# EAGLE design OctoWatchSchemePackage1 (EAGLE 9.4.2)
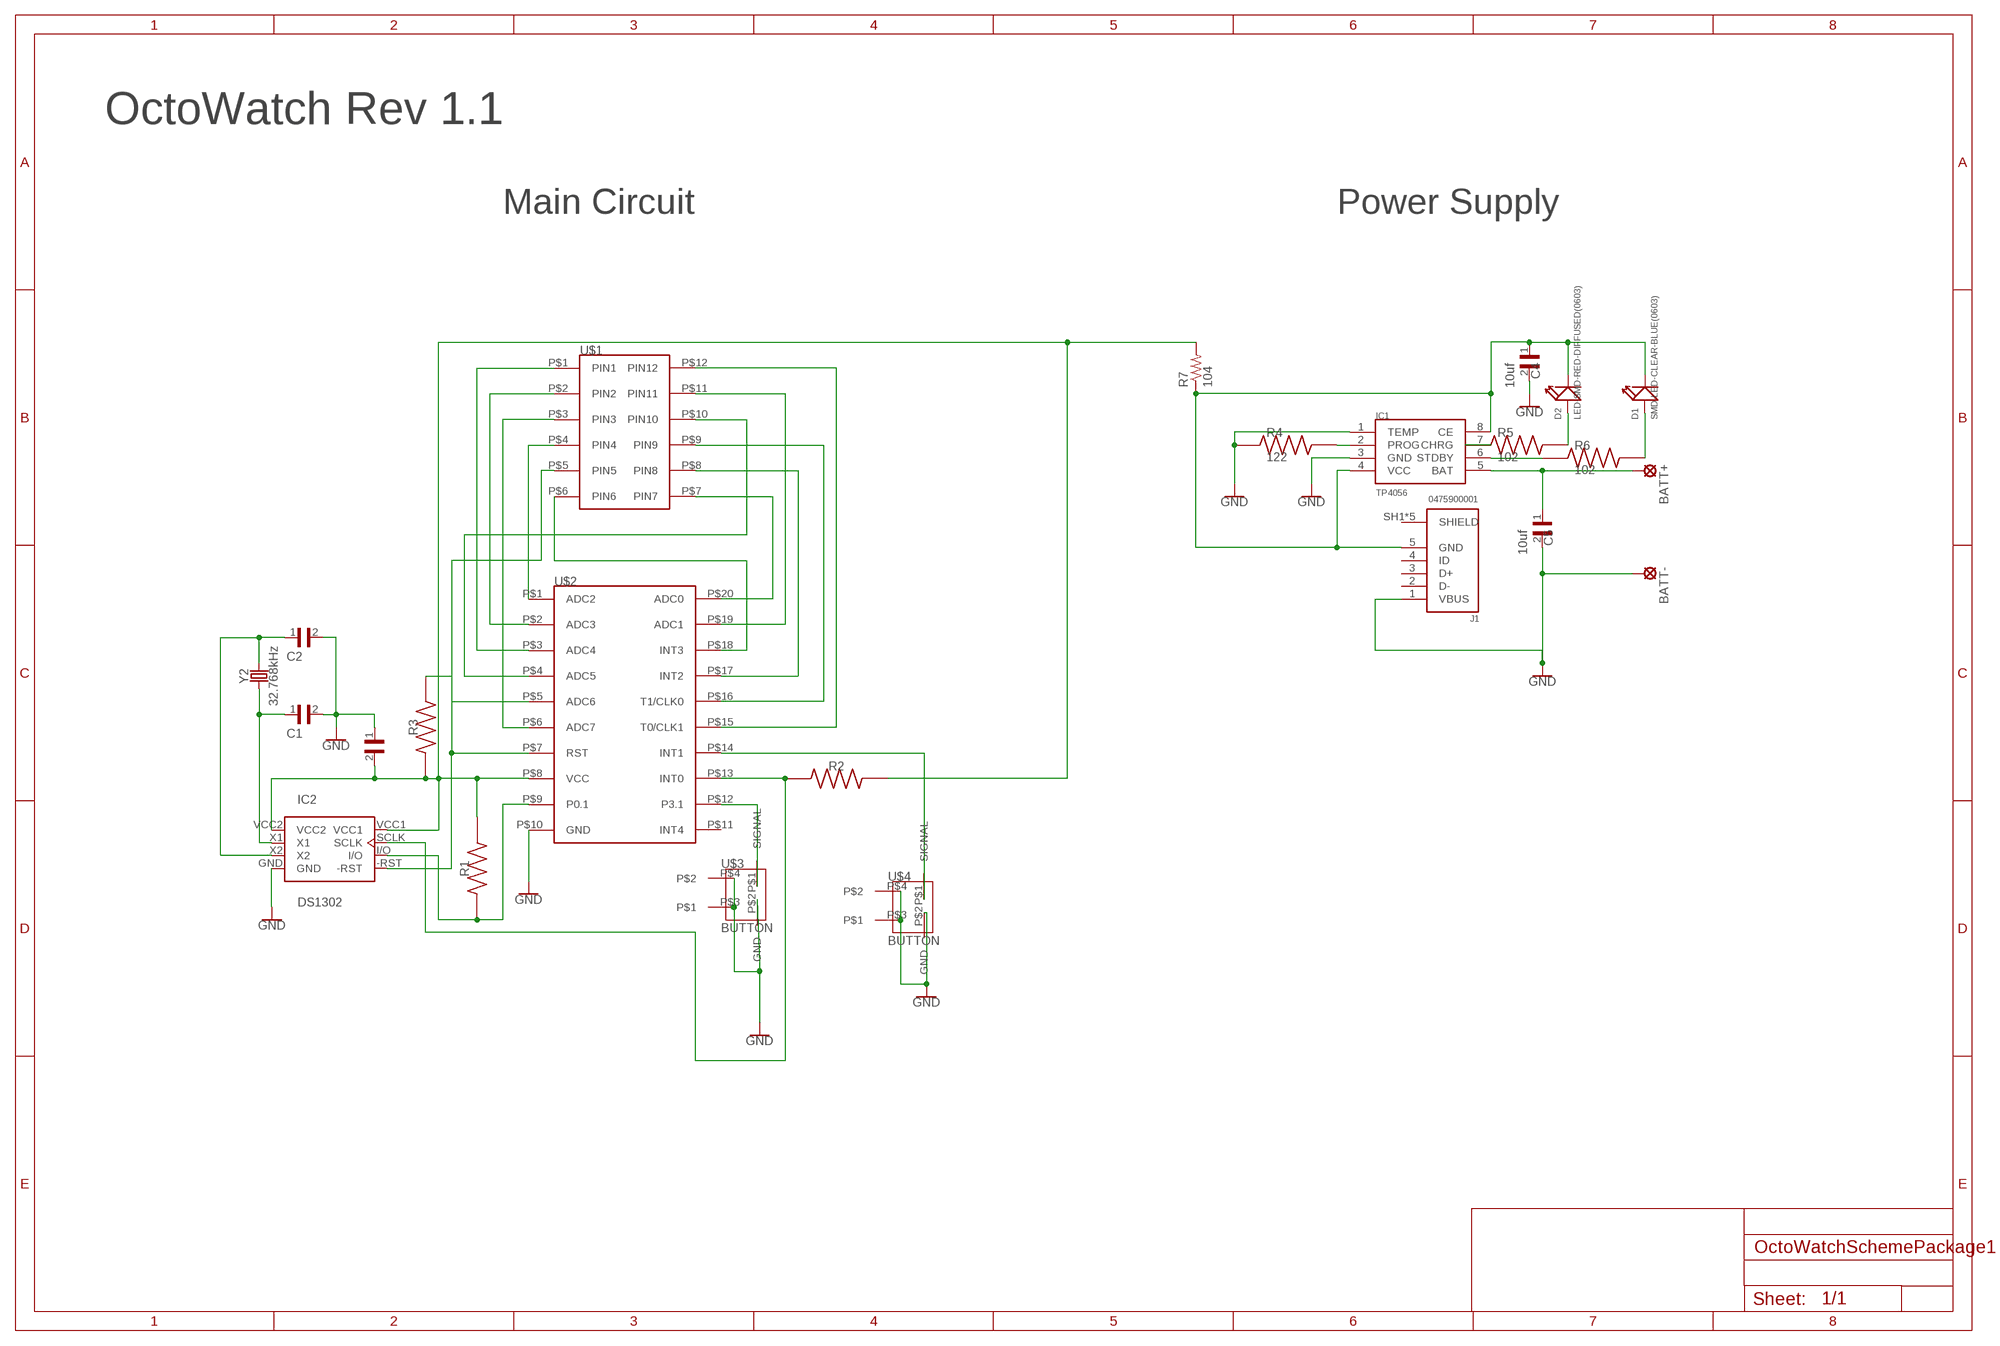
[diagram p0: schematic, sheet 1]

## Parts
BATT+  LSP13  [LSP13]
BATT-  LSP13  [LSP13]
C1  CL21C220JBANNNC  [CAPC2012X140N]
C2  CL21C220JBANNNC  [CAPC2012X140N]
C3  CL21B104KCFNNNE  [CAPC2012X140N]
C4  10uf  GRT188R61E106ME13D  [CAPC1608X100N]
C5  10uf  GRT188R61E106ME13D  [CAPC1608X100N]
D1  SMD-LED-CLEAR-BLUE(0603)  [LED-0603]
D2  LED-SMD-RED-DIFFUSED(0603)  [LED-0603]
IC1  TP4056  [SOP-8]
IC2  DS1302  [DIL08]
J1  0475900001  [0475900001]
R1  ERA3AEB103V  [RES_ERA3AEB103V]
R2  ERA3AEB103V  [RES_ERA3AEB103V]
R3  ERA3AEB103V  [RES_ERA3AEB103V]
R4  122  AC1206FR-073K9L  [RESC3116X65N]
R5  102  ERJ-PB3B1001V  [RESC1608X55N]
R6  102  ERJ-PB3B1001V  [RESC1608X55N]
R7  104  R-US_R0805  [R0805]
U$1  LED_SEGMENT  [LED_SEGMENT]
U$2  STC15F204AESTC15L204AE  [STC15F204AE2]
U$3  BUTTON  [BUTTON]
U$4  BUTTON  [BUTTON]
Y2  32.768kHz  CRYSTAL-32.768KHZPTH-2X6  [CRYSTAL-PTH-2X6-CYL]

## Nets
BATT+: C3.2 IC2.VCC1 IC2.VCC2 R1.2 R2.2 R3.1 R7.2 U$2.P$8(VCC)
GND: BATT-.MP C1.2 C2.2 C3.1 C4.2 C5.2 IC1.1(TEMP) IC1.3(GND) IC2.GND J1.1(VBUS) R4.1 U$2.P$10(GND) U$3.P$2(GND) U$3.P$3 U$3.P$4 U$4.P$2(GND) U$4.P$3 U$4.P$4
N$1: U$1.P$1(PIN1) U$2.P$3(ADC4)
N$2: U$1.P$2(PIN2) U$2.P$2(ADC3)
N$3: U$1.P$4(PIN4) U$2.P$1(ADC2)
N$4: U$1.P$3(PIN3) U$2.P$6(ADC7)
N$5: U$1.P$5(PIN5) U$2.P$5(ADC6)
N$6: U$1.P$6(PIN6) U$2.P$18(INT3)
N$7: U$1.P$7(PIN7) U$2.P$20(ADC0)
N$8: U$1.P$8(PIN8) U$2.P$17(INT2)
N$9: U$1.P$9(PIN9) U$2.P$16(T1/CLK0)
N$10: IC2.SCLK R2.1 U$2.P$13(INT0)
N$11: IC2.-RST R3.2 U$2.P$7(RST)
N$12: U$1.P$12(PIN12) U$2.P$15(T0/CLK1)
N$13: C1.1 IC2.X1 Y2.1
N$14: C4.1 D1.- D2.- IC1.4(VCC) IC1.8(CE) J1.5(GND) R7.1
N$15: C2.1 IC2.X2 Y2.2
N$16: U$1.P$10(PIN10) U$2.P$4(ADC5)
N$17: IC2.I/O R1.1 U$2.P$9(P0.1)
N$18: BATT+.MP C5.1 IC1.5(BAT)
N$19: U$2.P$14(INT1) U$4.P$1(SIGNAL)
N$20: U$2.P$12(P3.1) U$3.P$1(SIGNAL)
N$21: U$1.P$11(PIN11) U$2.P$19(ADC1)
N$26: IC1.6(STDBY) R6.1
N$27: D1.+ R6.2
N$28: IC1.7(CHRG) R5.1
N$29: D2.+ R5.2
N$31: IC1.2(PROG) R4.2
Unconnected: J1.2(D-) J1.3(D+) J1.4(ID) U$2.P$11(INT4)

## Notes on the sheet
- OctoWatch Rev 1.1
- Main Circuit | Power Supply

## Power pins joined to a net without a drawn wire
SHIELD: J1.SH1(SHIELD) J1.SH2(SHIELD) J1.SH3(SHIELD) J1.SH4(SHIELD) J1.SH5(SHIELD)

## Library data of the parts
BATT+ BATT- = solpad:LSP13: SOLDER PAD drill 1.3 mm, distributor Buerklin, 12H562
C1 C2 = CL21C220JBANNNC:CL21C220JBANNNC: KC 22pF 0805 5% 50V NP0 Check prices <https://pricing.snapeda.com/parts/CL21C220JBANNNC/Samsung%20Electro-Mechanics/view-part?ref=eda>; AVAILABILITY: In Stock; DESCRIPTION: 22pF ±5% 50V Ceramic Capacitor C0G, NP0 0805 (2012 Metric); MF: Samsung Electro-Mechanics; MP: CL21C220JBANNNC; PACKAGE: 2012-2 Samsung; PRICE: None
C3 = CL21B104KCFNNNE:CL21B104KCFNNNE: CL21 Series 0.1 uF 100V ±10 % Tolerance X7R SMT Multilayer Ceramic Capacitor Check prices <https://pricing.snapeda.com/parts/CL21B104KCFNNNE/Samsung/view-part?ref=eda>; AVAILABILITY: In Stock; DESCRIPTION: 0.1µF ±10% 100V Ceramic Capacitor X7R 0805 (2012 Metric); MF: Samsung; MP: CL21B104KCFNNNE; PACKAGE: 0805 Samsung; PRICE: None
C4 C5 = GRT188R61E106ME13D:GRT188R61E106ME13D: Cap Ceramic 10uF 25V X5R 20% Pad SMD 0603 85C Automotive T/R Check prices <https://pricing.snapeda.com/parts/GRT188R61E106ME13D/Murata/view-part?ref=eda>; AVAILABILITY: In Stock; DESCRIPTION: SMD Capacitor X5R(EIA) with Capacitance: 10uF Tol. 20%. Rated Voltage: 25Vdc; MF: Murata; MP: GRT188R61E106ME13D; PACKAGE: 1608 Murata; PRICE: None
D1 = SMD-LED-CLEAR-BLUE_0603_:SMD-LED-CLEAR-BLUE(0603): 304090045 Check prices <https://pricing.snapeda.com/parts/19-217/BHC-ZL1M2RY/3T/Everlight/view-part?ref=eda>; AVAILABILITY: Not in stock; DESCRIPTION: Blue LED Indication - Discrete 2.8V 0603 (1608 Metric); MF: Everlight; MP: 19-217/BHC-ZL1M2RY/3T; PACKAGE: 0603 Everlight; PRICE: None
D2 = LED-SMD-RED-DIFFUSED_0603_:LED-SMD-RED-DIFFUSED(0603): 304090042 Check prices <https://pricing.snapeda.com/parts/19-217/R6C-AL1M2VY/3T/Everlight%20Electronics/view-part?ref=eda>; AVAILABILITY: In Stock; DESCRIPTION: Red LED Indication - Discrete 1.95V 0603 (1608 Metric); MF: Everlight Electronics; MP: 19-217/R6C-AL1M2VY/3T; PACKAGE: 0603 Everlight Electronics; PRICE: None
IC1 = TP4056:TP4056
IC2 = ds1302:DS1302: Real-time clock (RTC) counts seconds, minutes hours, date of the month, month, day of the week, and year with leap-year compensation valid up to 2100
J1 = USB connector:0475900001: CONN RCPT MICRO USB AB 5P SMD RA Manufacturer's datasheet <https://www.molex.com/pdm_docs/sd/475900001_sd.pdf>; CREATED_BY: PCBLayout.com; DIGIKEY_PARTNO: WM17144TR-ND; MANUFACTURER: Molex; MPN: 0475900001
R1-R3 = ERA3AEB103V:ERA3AEB103V: Check prices <https://pricing.snapeda.com/parts/ERA3AEB103V/Panasonic/view-part?ref=eda>; AVAILABILITY: No availability data; DESCRIPTION: 10 kOhms ±0.1% 0.1W, 1/10W Chip Resistor 0603 (1608 Metric) Automotive AEC-Q200 Thin Film; MF: Panasonic; MP: ERA3AEB103V; PACKAGE: 1608-2 Panasonic; PRICE: None
R4 = AC1206FR-073K9L:AC1206FR-073K9L: AC1206 3,90K 1% 0,25W AUTOMO Check prices <https://pricing.snapeda.com/parts/AC1206FR-073K9L/Yageo/view-part?ref=eda>; AVAILABILITY: In Stock; DESCRIPTION: Res Thick Film 1206 3.9K Ohm 1% 0.25W(1/4W) ±100ppm/°C Pad SMD Automotive T/R; MF: Yageo; MP: AC1206FR-073K9L; PACKAGE: 3116 Yageo; PRICE: None
R5 R6 = ERJ-PB3B1001V:ERJ-PB3B1001V: Res Thick Film 0603 1K Ohm 0.1% 0.2W(1/5W) ±50ppm/C Pad SMD Automotive T/R Check prices <https://pricing.snapeda.com/parts/ERJ-PB3B1001V/Panasonic%20Electronic/view-part?ref=eda>; AVAILABILITY: In Stock; DESCRIPTION: 1 kOhms ±0.1% 0.2W, 1/5W Chip Resistor 0603 (1608 Metric) Automotive AEC-Q200, Pulse Withstanding Thick Film; MF: Panasonic Electronic; MP: ERJ-PB3B1001V; PACKAGE: 1608 Panasonic Electronic Components; PRICE: None
R7 = rcl:R-US_: RESISTOR, American symbol; SPICEPREFIX: R
U$1 = OctoWatch:LED_SEGMENT: 7 segment led LCD 7mm
U$2 = OctoWatch:STC15F204AE: 15L204AE microchip for watch
U$3 U$4 = OctoWatch:BUTTON
Y2 = SparkFun-Clocks:CRYSTAL-32.768KHZ: 32.768kHz Crystal Frequency: 32.768kHz Frequency Stability: ±20ppm Load Capacitance: 12.5pF (PTH-2X6 & SMD-3.2X1.5), 6pF (SMD-2X6) SparkFun Products: SparkFun BigTime Watch Kit <https://www.sparkfun.com/products/11734> SparkFun nRF52832 Breakout <https://www.sparkfun.com/products/13990> SparkFun Real Time Clock Module <https://www.sparkfun.com/products/12708>; PROD_ID: XTAL-10112

## Board
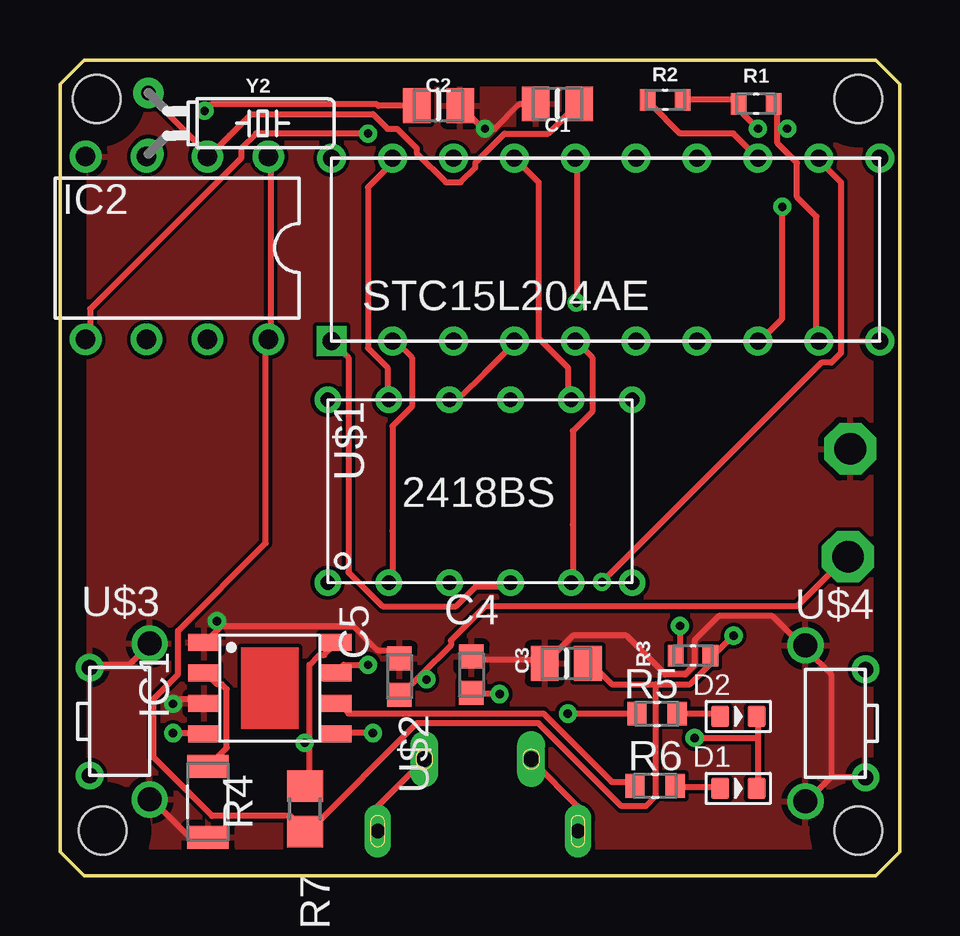
[diagram p1: board, top side]
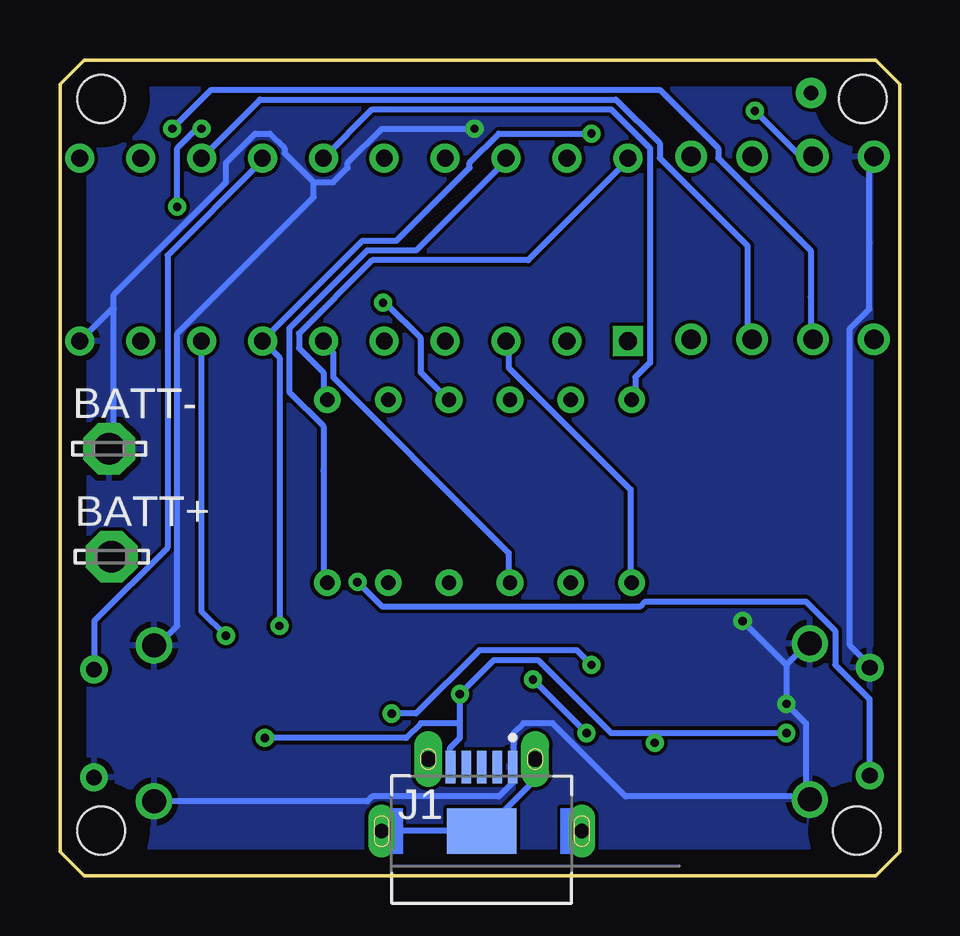
[diagram p2: board, bottom side, seen from below]

Size 35 x 34 mm. Coordinates in mm from the lower left corner, seen from the top.
Outline: 0,33 0,1 1,0 34,0 35,1 35,33 34,34 1,34 0,33
Copper layers (1*16): Top 0.035mm / dielectric 1.5mm / Bottom 0.035mm
Design rules "default *": minimum track width 10mil, minimum drill 0.35mm, track to track 6mil, track to pad 6mil, pad to pad 6mil, via to via 6mil, smd to smd 6mil, copper to edge 40mil, drill to drill 6mil, minimum pad ring 10mil, minimum via ring 8mil, stop-mask expansion 4mil, vias tented up to drill 0mil, thermal gap 10mil
Holes 2 mm at 33.28,32.38 1.53,32.38 1.78,1.88 33.28,1.88

### Footprints (pad centres in the part's own frame; a part is rotated, then mirrored left to right if it is on the bottom)
LSP13 = drill 1.321 pad 2.159 octagon: MP 0,0
CAPC2012X140N = smd 1.15 x 1.45: 1 -0.9,0; 2 0.9,0
CAPC1608X100N = smd 1 x 1.02: 1 -0.759,0; 2 0.759,0
LED-0603 = smd 0.762 x 0.889: + -0.762,0; - 0.762,0
SOP-8 = smd 1.3 x 0.7: 1 -2.75,1.905; 2 -2.75,0.635; 3 -2.75,-0.635; 4 -2.75,-1.905; 5 2.75,-1.905; 6 2.75,-0.635; 7 2.75,0.635; 8 2.75,1.905
DIL08 = drill 0.813: -RST 3.81,3.81; GND 3.81,-3.81; I/O 1.27,3.81; SCLK -1.27,3.81; VCC1 -3.81,3.81; VCC2 -3.81,-3.81; X1 -1.27,-3.81; X2 1.27,-3.81
0475900001 = smd 0.4 x 1.35: 1 1.3,2.675; 2 0.65,2.675; 3 0,2.675; 4 -0.65,2.675; 5 -1.3,2.675 | drill 0.65 pad 0.85 long: SH1 -2.225,3; SH2 2.225,3 | drill 0.6 pad 0.8 long: SH3 -4.175,0; SH4 4.175,0 | smd 2.9 x 1.9: SH5 0,0
RES_ERA3AEB103V = smd 0.65 x 0.9: 1 -0.725,0; 2 0.725,0
RESC3116X65N = smd 0.97 x 1.73: 1 -1.48,0; 2 1.48,0
RESC1608X55N = smd 0.8 x 0.98: 1 -0.837,0; 2 0.837,0
R0805 = smd 1.3 x 1.5: 1 -0.95,0; 2 0.95,0
LED_SEGMENT = drill 0.6: P$1 -12.7,7.62; P$2 -12.7,5.08; P$3 -12.7,2.54; P$4 -12.7,0; P$5 -12.7,-2.54; P$6 -12.7,-5.08; P$7 -5.08,-5.08; P$8 -5.08,-2.54; P$9 -5.08,0; P$10 -5.08,2.54; P$11 -5.08,5.08; P$12 -5.08,7.62
STC15F204AE2 = drill 0.75 square: P$1 -12.7,10.16 | drill 0.7: P$2 -12.7,7.62; P$3 -12.7,5.08; P$4 -12.7,2.54; P$5 -12.7,0; P$6 -12.7,-2.54; P$7 -12.7,-5.08; P$8 -12.7,-7.62; P$9 -12.7,-10.16; P$10 -12.7,-12.7; P$11 -5.08,-12.7; P$12 -5.08,-10.16; P$13 -5.08,-7.62; P$14 -5.08,-5.08; P$15 -5.08,-2.54; P$16 -5.08,0; P$17 -5.08,2.54; P$18 -5.08,5.08; P$19 -5.08,7.62; P$20 -5.08,10.16
BUTTON = drill 0.65: P$1 -9,4.5; P$2 -9,0 | drill 1: P$3 -11.5,-1; P$4 -11.5,5.5
CRYSTAL-PTH-2X6-CYL = drill 0.6 pad 1.27: 1 -1.27,0; 2 1.27,0

### Placement (x,y rotation side)
BATT+  32.85,13.29 0 bottom
BATT-  32.95,17.79 0 bottom
C1  20.74,32.17 180 top
C2  15.78,32.09 0 top
C3  21.11,8.84 0 top
C4  17.15,8.37 90 top
C5  14.15,8.29 90 top
D1  28.28,3.63 0 top
D2  28.28,6.63 0 top
IC1  8.75,7.81 0 top
IC2  4.88,26.16 180 top
J1  17.42,1.85 0 bottom
R1  29.02,32.17 180 top
R2  25.23,32.34 0 top
R3  26.39,9.17 180 top
R4  6.17,3.07 90 top
R5  24.89,6.74 0 top
R6  24.81,3.74 0 top
R7  10.21,2.78 270 top
U$1  18.78,24.91 90 top
U$2  21.48,34.98 90 top
U$3  -7.76,8.67 180 top
U$4  42.58,4.09 0 top
Y2  3.69,31.36 270 top

### Tracks (layer width: path | path; a pad name or v marks a point on that pad's centre or on a via)
BATT+  (via drill 0.35)
  Top 0.254: R2.2 26.05,32.35 28.29,32.35 R1.2 28.49,32.15 28.49,31.74 v29.1,31.13 | v30.11,27.88 30.11,23.21 29.3,22.4 U$2.P$8 | IC2.VCC2 8.78,29.91 8.78,22.4 IC2.VCC1 8.58,22.19 8.58,13.86 4.92,10.21 4.92,8.38 3.9,7.36 3.9,4.92 6.34,2.48 9.59,2.48 10.2,1.87 R7.2 10.4,1.87 14.87,6.34 19.95,6.34 23.41,2.89 24.43,2.89 24.83,3.3 24.83,7.97 | 24.83,7.97 23,7.97 22.19,8.78 C3.2 | 24.83,7.97 26.25,7.97 27.07,8.78 27.07,8.99 R3.1 27.27,9.19 v28.08,10
  Bottom 0.254: v29.1,31.13 29.3,31.13 30.11,30.32 v30.11,27.88 | v28.08,10 29.1,11.02 29.1,22.19 U$2.P$8
GND  (via drill 0.35)
  Top 0.254: 14.11,9.35 C5.2 | 14.31,9.35 C5.2 | 16.95,9.35 C4.2 17.31,8.99 20.16,8.99 C3.1 20.36,8.99 21.38,10 23.61,10 25.24,8.38 26.05,8.38 26.46,8.78 26.46,9.8 27.47,10.81 29.71,10.81 30.93,9.6 U$4.P$4 31.13,9.39 32.15,8.38 32.15,4.11 | 5.57,7.39 IC1.3 5.53,7.36 4.92,7.36 v4.71,7.16 | C1.2 19.75,32.15 19.14,32.15 18.13,31.13 v17.72,31.13 17.64,31.13 C2.2 | 32.15,4.11 33.57,4.11 U$4.P$2 | 32.15,4.11 31.13,3.09 U$4.P$3 | R4.1 6.14,1.67 5.32,1.67 3.9,3.09 U$3.P$4 | 6.75,10.41 12.23,10.41 13.25,9.39 14.06,9.39 C5.2 | 6.75,10.41 6.14,9.8 IC1.1 | U$3.P$2 1.26,8.78 2.89,8.78 3.7,9.6 U$3.P$3 | v6.54,10.61 6.75,10.41
  Bottom 0.254: v17.72,31.13 21.58,31.13 23,29.71 23,29.51 23.61,28.9 24.43,28.9 | 24.43,28.9 25.64,30.12 25.64,30.32 26.25,30.93 26.86,30.93 28.08,29.71 28.08,28.9 32.76,24.23 32.76,23.63 | 32.76,23.63 32.76,17.93 BATT-.MP | 3.9,3.3 11.42,3.3 14.47,6.34 15.69,6.34 16.09,5.94 16.09,4.72 J1.1 16.09,4.52 16.09,3.91 16.7,3.3 21.99,3.3 22.19,3.09 30.93,3.09 U$4.P$3 | 4.71,8.78 v4.71,7.16 3.9,6.34 3.9,3.3 | 4.71,8.78 3.9,9.6 U$3.P$3 | IC2.GND 1.26,29.91 1.26,26.38 1.26,23.62 2.07,22.8 2.07,9.6 1.26,8.78 U$3.P$2 | 4.71,8.78 v6.54,10.61 | 3.9,3.3 U$3.P$4 | 24.43,28.9 24.43,28.29 30.11,22.6 30.11,10.41 30.93,9.6 U$4.P$4 | U$2.P$10 32.83,23.63 32.76,23.63
  pour Top: 1.03,33.88 33.78,33.88 34.78,32.88 34.78,1.13 33.78,0.13 1.03,0.13 0.03,1.13 0.03,32.88
  pour Bottom: 1.03,33.88 33.78,33.88 34.78,32.88 34.78,1.13 33.78,0.13 1.03,0.13 0.03,1.13 0.03,32.88
N$1
  Bottom 0.254: U$1.P$1 11.22,12.24 11.22,16.1 13.27,18.14 16.3,21.18 16.3,22.19 U$2.P$3
N$2
  Top 0.254: U$1.P$2 13.86,12.24 13.86,14.38 13.86,18.74 14.67,19.55 14.67,21.58 14.06,22.19 U$2.P$2
N$3
  Top 0.254: U$1.P$4 18.73,12.03 17.31,12.03 16.5,11.22 13.45,11.22 12.03,12.64 12.03,21.58 11.42,22.19 U$2.P$1
N$4
  Bottom 0.254: U$1.P$3 16.3,12.24 16.3,13.46 17,14.16 23.61,20.77 23.61,21.79 24.02,22.19 U$2.P$6
N$5
  Top 0.254: U$1.P$5 21.38,12.24 21.38,14.63 21.38,18.54 22.19,19.35 22.19,21.58 21.58,22.19 U$2.P$5
N$6
  Bottom 0.254: U$1.P$6 24.02,12.24 24.02,16.88 24.02,18.74 25.44,20.16 25.44,22.8 22.19,26.05 20.16,26.05 16.5,29.71 U$2.P$18
N$7
  Bottom 0.254: U$1.P$7 24.02,19.96 24.02,20.97 24.23,21.18 25.03,21.99 25.03,22.6 21.99,25.65 15.48,25.65 11.42,29.71 U$2.P$20
N$8
  Top 0.254: U$1.P$8 21.17,19.96 21.17,21.18 20.75,21.6 19.95,22.4 19.95,28.9 19.14,29.71 U$2.P$17
N$9  (via drill 0.35)
  Top 0.254: U$2.P$16 21.58,29.71 21.58,24.02 v21.53,23.88
  Bottom 0.254: v21.53,23.88 21.38,23.82 19.95,22.4 19.95,20.97 19.7,20.71 18.94,19.96 U$1.P$9
N$10
  Top 0.254: R2.1 24.63,32.15 25.85,30.93 28.08,30.93 29.1,29.91 U$2.P$13
  Bottom 0.254: IC2.SCLK 6.34,22.4 6.34,24.13 6.34,26.26 10,29.91 10,30.53 11.83,32.35 26.66,32.35 29.1,29.91 U$2.P$13
N$11  (via drill 0.35)
  Top 0.254: v25.85,10.41 25.85,9.19 R3.2 | v12.84,30.93 8.17,30.93 7.56,30.32 7.56,29.91 1.9,24.26 1.26,23.62 1.26,22.4 IC2.-RST
  Bottom 0.254: v25.85,10.41 25.85,21.58 26.46,22.19 U$2.P$7 26.46,22.4 22.39,26.46 20.97,26.46 17.92,29.51 17.92,29.71 16.7,30.93 v12.84,30.93
N$12
  Bottom 0.254: U$1.P$12 11.01,19.96 11.01,20.77 10.4,21.38 10.4,23.13 10.4,30.32 12.03,31.95 21.99,31.95 24.02,29.91 U$2.P$15
N$13
  Top 0.254: C1.1 21.58,32.15 20.36,30.93 18.53,30.93 17.31,29.71 17.31,29.51 16.7,28.9 16.09,28.9 14.87,30.12 14.87,30.32 14.06,31.13 13.66,31.13 13.05,31.74 7.97,31.74 7.07,30.84 6.34,30.12 IC2.X1 6.14,30.12 3.7,32.56 Y2.1
N$14  (via drill 0.35)
  Top 0.254: 6.18,5.77 IC1.4 5.93,5.94 v4.71,5.94 | 10.4,5.53 10.4,3.91 R7.1 | 10.4,5.53 10.4,8.78 10.81,9.19 11.01,9.19 11.42,9.6 IC1.8 | 29.1,5.73 29.1,6.55 D2.- | 29.1,5.73 29.1,3.7 D1.- | v18.33,7.56 17.31,7.56 C4.1 | v26.46,5.73 29.1,5.73 | v10.2,5.53 10.4,5.53
  Bottom 0.254: 18.33,6.13 18.33,5.73 18.73,5.33 18.73,4.72 J1.5 | 18.33,6.13 18.33,6.34 | 18.33,6.34 v18.33,7.56 16.91,8.99 15.08,8.99 12.03,5.94 10.2,5.94 | 10.2,5.94 v4.71,5.94 | v26.46,5.73 20.56,5.73 19.95,6.34 18.33,6.34 | 10.2,5.94 v10.2,5.53 | 18.33,6.13
N$15  (via drill 0.35)
  Top 0.254: Y2.2 3.7,30.12 IC2.X2 | C2.1 13.27,32.09 13.21,32.15 6.3,32.15 v6.03,31.88
  Bottom 0.254: v6.03,31.88 4.12,29.97 IC2.X2
N$16
  Top 0.254: U$1.P$10 16.3,19.96 16.7,19.96 17.7,20.96 18.94,22.19 U$2.P$4
N$17  (via drill 0.35)
  Top 0.254: 29.91,31.13 29.91,30.53 30.72,29.71 30.72,28.29 31.54,27.48 31.54,22.4 U$2.P$9 | 29.91,31.13 29.91,32.15 R1.1 | 29.91,31.13 v30.32,31.13
  Bottom 0.254: v30.32,31.13 28.69,32.76 10,32.76 7.56,30.32 7.56,29.91 3.7,26.05 3.7,24.13 3.7,22.4 IC2.I/O
N$18  (via drill 0.35)
  Top 0.254: 11.67,5.77 IC1.5 11.62,5.94 v13.05,5.94 | 15.08,8.38 16.3,9.6 16.3,9.8 17.72,11.22 30.72,11.22 32.76,13.25 BATT+.MP | 15.08,8.38 14.27,7.56 C5.1 | 15.08,8.38 v15.28,8.17
  Bottom 0.254: v15.28,8.17 v13.05,5.94
N$19
  Bottom 0.254: U$4.P$1 33.57,8.78 33.57,10.61 30.52,13.66 30.52,25.85 26.66,29.71 U$2.P$14
N$20  (via drill 0.35)
  Top 0.254: v22.6,12.24 31.74,21.38 32.15,21.38 32.55,21.79 32.55,28.9 31.74,29.71 U$2.P$12
  Bottom 0.254: v22.6,12.24 21.58,11.22 10.81,11.22 10.61,11.42 3.9,11.42 2.68,10.21 2.68,8.78 1.26,7.36 1.26,4.31 U$3.P$1
N$21
  Top 0.254: U$1.P$11 13.66,19.96 13.66,21.18 12.84,21.99 12.84,28.7 13.86,29.71 U$2.P$19
N$26
  Top 0.254: 24.22,3.78 R6.1 23.81,3.91 23,3.91 20.16,6.75 12.03,6.75 11.62,7.16 IC1.6
N$27
  Top 0.254: 25.44,3.78 R6.2 25.85,3.7 27.47,3.7 D1.+
N$28  (via drill 0.35)
  Top 0.254: 11.67,8.41 IC1.7 | 24.22,6.67 R5.1 24.02,6.75 v21.17,6.75 | 11.67,8.61 IC1.7 | v12.84,8.78 11.83,8.78 11.62,8.58 IC1.7
  Bottom 0.254: v21.17,6.75 20.16,6.75 17.52,9.39 13.45,9.39 v12.84,8.78
N$29
  Top 0.254: 25.44,6.67 R5.2 25.85,6.75 27.47,6.75 D2.+
N$31
  Top 0.254: 6.18,8.41 IC1.2 6.14,8.38 6.54,7.97 6.75,7.97 6.95,7.77 6.95,5.33 6.34,4.72 R4.2
SHIELD
  Top 0.254: J1.SH3 21.58,1.87 21.58,2.89 19.75,4.72 J1.SH1 | J1.SH4 13.25,1.87 13.25,2.89 15.08,4.72 J1.SH2
  Bottom 0.254: J1.SH2 15.28,4.72 15.28,3.91 17.31,1.87 J1.SH5 17.52,1.87 21.58,1.87 J1.SH3